# Altium schematic sheet sche.SchDoc
size B; Organization: Altium Limited; Address1: L3, 12a Rodborough Rd; Address2: Frenchs Forest; Address3: NSW; Address4: Australia 2086
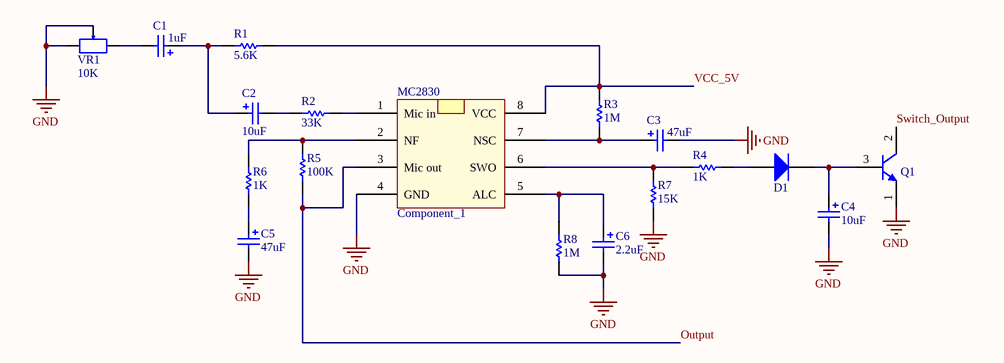
[diagram p0: sche.SchDoc]

## Parts
C1  value 1uF  [CP1/2]  (hidden comment: Cap Pol)
C2  value 10uF  [CP1/2]  (hidden comment: Cap Pol)
C3  value 47uF  [CP1/2.5]  (hidden comment: Cap Pol)
C4  value 10uF  [CP1/2]  (hidden comment: Cap Pol)
C5  value 47uF  [CP1/2.5]  (hidden comment: Cap Pol)
C6  value 2.2uF  [CP1/2]  (hidden comment: Cap Pol)
D1  Diode  [D1A]  (value not drawn)
MC2830  Component_1  [DIP8]
Q1  C1815  [QTO-92]  (value not drawn)
R1  value 5.6K  [RES 1/2W]  (hidden comment: RESISTOR)
R2  value 33K  [RES 1/2W]  (hidden comment: RESISTOR)
R3  value 1M  [RES 1/2W]  (hidden comment: RESISTOR)
R4  value 1K  [RES 1/2W]  (hidden comment: RESISTOR)
R5  value 100K  [RES 1/2W]  (hidden comment: RESISTOR)
R6  value 1K  [RES 1/2W]  (hidden comment: RESISTOR)
R7  value 15K  [RES 1/2W]  (hidden comment: RESISTOR)
R8  value 1M  [RES 1/2W]  (hidden comment: RESISTOR)
VR1  10K  [VR]

## Nets
GND: C3.2 C4.2 C5.2 C6.2 MC2830.4(GND) Q1.1(E) R7.1 R8.1 VR1.1 VR1.2
Output: MC2830.3(Mic_out) R5.1
Switch_Output: Q1.2(C)
VCC_5V: MC2830.8(VCC) R1.2 R3.2
NetC1_1: C1.1 C2.1 R1.1
NetC1_2: C1.2 VR1.3
NetC2_2: C2.2 R2.1
NetC3_1: C3.1 MC2830.7(NSC) R3.1
NetC4_1: C4.1 D1.2(K) Q1.3(B)
NetC5_1: C5.1 R6.1
NetC6_1: C6.1 MC2830.5(ALC) R8.2
NetD1_1: D1.1(A) R4.2
NetMC2830_1: MC2830.1(Mic_in) R2.2
NetMC2830_2: MC2830.2(NF) R5.2 R6.2
NetMC2830_6: MC2830.6(SWO) R4.1 R7.2

## Notes on the sheet
- Title
- Size:
- Date:
- B
- Number:
- Time:
- Revision:
- Sheet
- of
- File:

## Library data of the parts
C1-C6 = Cap Pol: Polarized Capacitor (Radial)
D1 = Diode: Default Diode
Q1 = C1815: NPN Bipolar Transistor
VR1 = VR: Var Resistor; Value: VR 10K